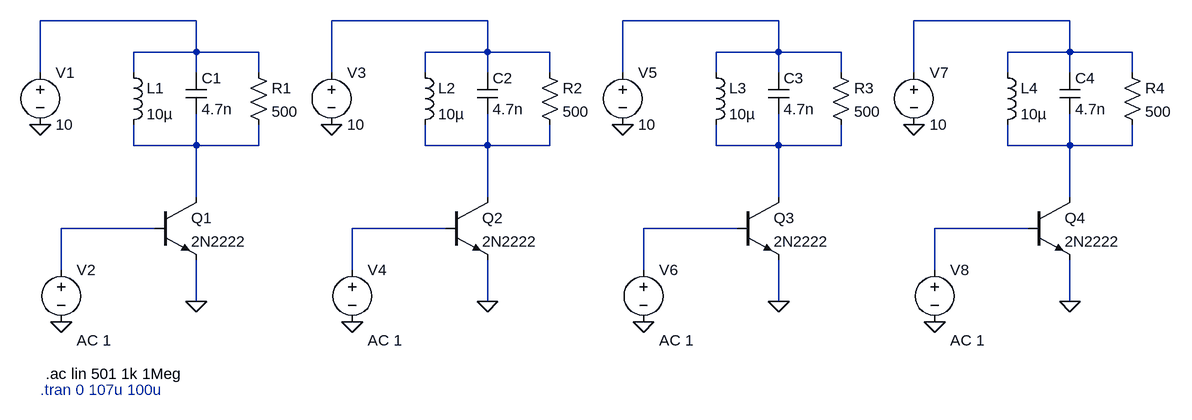
[diagram p0: schematic 750KHz Amplifier (Narrow band for CW).asc]
750KHz Amplifier (Narrow band for CW).asc, the LTspice schematic file:
Version 4.1
SHEET 1 1860 680
WIRE 352 -48 112 -48
WIRE 800 -48 560 -48
WIRE 1248 -48 1008 -48
WIRE 1696 -48 1456 -48
WIRE 352 0 352 -48
WIRE 352 0 256 0
WIRE 448 0 352 0
WIRE 800 0 800 -48
WIRE 800 0 704 0
WIRE 896 0 800 0
WIRE 1248 0 1248 -48
WIRE 1248 0 1152 0
WIRE 1344 0 1248 0
WIRE 1696 0 1696 -48
WIRE 1696 0 1600 0
WIRE 1792 0 1696 0
WIRE 112 32 112 -48
WIRE 256 32 256 0
WIRE 352 32 352 0
WIRE 448 32 448 0
WIRE 560 32 560 -48
WIRE 704 32 704 0
WIRE 800 32 800 0
WIRE 896 32 896 0
WIRE 1008 32 1008 -48
WIRE 1152 32 1152 0
WIRE 1248 32 1248 0
WIRE 1344 32 1344 0
WIRE 1456 32 1456 -48
WIRE 1600 32 1600 0
WIRE 1696 32 1696 0
WIRE 1792 32 1792 0
WIRE 256 144 256 112
WIRE 352 144 352 96
WIRE 352 144 256 144
WIRE 448 144 448 112
WIRE 448 144 352 144
WIRE 704 144 704 112
WIRE 800 144 800 96
WIRE 800 144 704 144
WIRE 896 144 896 112
WIRE 896 144 800 144
WIRE 1152 144 1152 112
WIRE 1248 144 1248 96
WIRE 1248 144 1152 144
WIRE 1344 144 1344 112
WIRE 1344 144 1248 144
WIRE 1600 144 1600 112
WIRE 1696 144 1696 96
WIRE 1696 144 1600 144
WIRE 1792 144 1792 112
WIRE 1792 144 1696 144
WIRE 352 224 352 144
WIRE 800 224 800 144
WIRE 1248 224 1248 144
WIRE 1696 224 1696 144
WIRE 288 272 144 272
WIRE 736 272 592 272
WIRE 1184 272 1040 272
WIRE 1632 272 1488 272
WIRE 144 336 144 272
WIRE 592 336 592 272
WIRE 1040 336 1040 272
WIRE 1488 336 1488 272
WIRE 352 384 352 320
WIRE 800 384 800 320
WIRE 1248 384 1248 320
WIRE 1696 384 1696 320
FLAG 112 112 0
FLAG 352 384 0
FLAG 144 416 0
FLAG 560 112 0
FLAG 800 384 0
FLAG 592 416 0
FLAG 1008 112 0
FLAG 1248 384 0
FLAG 1040 416 0
FLAG 1456 112 0
FLAG 1696 384 0
FLAG 1488 416 0
SYMBOL voltage 112 16 R0
WINDOW 123 0 0 Left 0
WINDOW 39 0 0 Left 0
SYMATTR InstName V1
SYMATTR Value 10
SYMBOL ind 240 16 R0
SYMATTR InstName L1
SYMATTR Value 10µ
SYMBOL cap 336 32 R0
SYMATTR InstName C1
SYMATTR Value 4.7n
SYMBOL res 432 16 R0
SYMATTR InstName R1
SYMATTR Value 500
SYMBOL npn 288 224 R0
SYMATTR InstName Q1
SYMATTR Value 2N2222
SYMBOL voltage 144 320 R0
WINDOW 123 24 124 Left 2
WINDOW 39 0 0 Left 0
SYMATTR InstName V2
SYMATTR Value ""
SYMATTR Value2 AC 1
SYMBOL voltage 560 16 R0
WINDOW 123 0 0 Left 0
WINDOW 39 0 0 Left 0
SYMATTR InstName V3
SYMATTR Value 10
SYMBOL ind 688 16 R0
SYMATTR InstName L2
SYMATTR Value 10µ
SYMBOL cap 784 32 R0
SYMATTR InstName C2
SYMATTR Value 4.7n
SYMBOL res 880 16 R0
SYMATTR InstName R2
SYMATTR Value 500
SYMBOL npn 736 224 R0
SYMATTR InstName Q2
SYMATTR Value 2N2222
SYMBOL voltage 592 320 R0
WINDOW 123 24 124 Left 2
WINDOW 39 0 0 Left 0
SYMATTR InstName V4
SYMATTR Value ""
SYMATTR Value2 AC 1
SYMBOL voltage 1008 16 R0
WINDOW 123 0 0 Left 0
WINDOW 39 0 0 Left 0
SYMATTR InstName V5
SYMATTR Value 10
SYMBOL ind 1136 16 R0
SYMATTR InstName L3
SYMATTR Value 10µ
SYMBOL cap 1232 32 R0
SYMATTR InstName C3
SYMATTR Value 4.7n
SYMBOL res 1328 16 R0
SYMATTR InstName R3
SYMATTR Value 500
SYMBOL npn 1184 224 R0
SYMATTR InstName Q3
SYMATTR Value 2N2222
SYMBOL voltage 1040 320 R0
WINDOW 123 24 124 Left 2
WINDOW 39 0 0 Left 0
SYMATTR InstName V6
SYMATTR Value ""
SYMATTR Value2 AC 1
SYMBOL voltage 1456 16 R0
WINDOW 123 0 0 Left 0
WINDOW 39 0 0 Left 0
SYMATTR InstName V7
SYMATTR Value 10
SYMBOL ind 1584 16 R0
SYMATTR InstName L4
SYMATTR Value 10µ
SYMBOL cap 1680 32 R0
SYMATTR InstName C4
SYMATTR Value 4.7n
SYMBOL res 1776 16 R0
SYMATTR InstName R4
SYMATTR Value 500
SYMBOL npn 1632 224 R0
SYMATTR InstName Q4
SYMATTR Value 2N2222
SYMBOL voltage 1488 320 R0
WINDOW 123 24 124 Left 2
WINDOW 39 0 0 Left 0
SYMATTR InstName V8
SYMATTR Value ""
SYMATTR Value2 AC 1
TEXT 112 520 Left 2 ;.tran 0 107u 100u
TEXT 120 496 Left 2 !.ac lin 501 1k 1Meg

The netlist it stands for:
* 750KHz Amplifier (Narrow band for CW).asc
V1 N001 0 10
L1 N001 N005 10µ
C1 N001 N005 4.7n
R1 N001 N005 500
Q1 N005 N009 0 0 2N2222
V2 N009 0 AC 1
V3 N002 0 10
L2 N002 N006 10µ
C2 N002 N006 4.7n
R2 N002 N006 500
Q2 N006 N010 0 0 2N2222
V4 N010 0 AC 1
V5 N003 0 10
L3 N003 N007 10µ
C3 N003 N007 4.7n
R3 N003 N007 500
Q3 N007 N011 0 0 2N2222
V6 N011 0 AC 1
V7 N004 0 10
L4 N004 N008 10µ
C4 N004 N008 4.7n
R4 N004 N008 500
Q4 N008 N012 0 0 2N2222
V8 N012 0 AC 1
.model NPN NPN
.model PNP PNP
.lib standard.bjt
* .tran 0 107u 100u
.ac lin 501 1k 1Meg
.backanno
.end